# Altium schematic sheet LM35.SchDoc
size A4
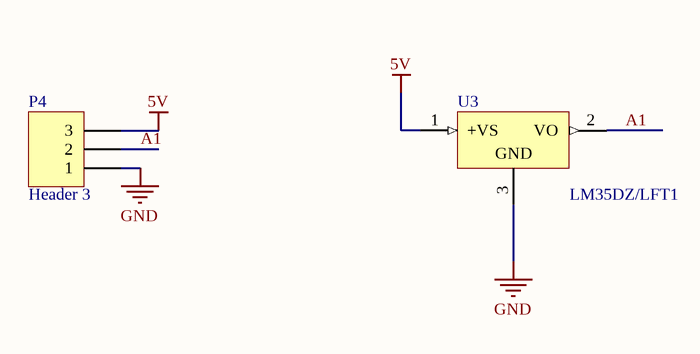
[diagram p0: LM35.SchDoc]

## Parts
P4  Header 3  [HDR1X3]
U3  LM35DZ/LFT1  [Z03A]

## Nets
5V: P4.3 U3.1(+VS)
GND: P4.1 U3.3(GND)
A1: P4.2 U3.2(VO)

## Library data of the parts
P4 = Header 3: Header, 3-Pin; LatestRevisionDate: 17-Jul-2002; LatestRevisionNote: Re-released for DXP Platform.; Publisher: Altium Limited
U3 = LM35DZ/LFT1: IC SENSOR PREC CENT TEMP TO92-3; Manufacturer: Texas Instruments; Sensing Temperature: 0°C ~ 100°C; Output Type: Linear Voltage; Voltage - Supply: 4 V ~ 30 V; Accuracy: ±0.6°C; Supplier 1: Digi-Key; RoHS: RoHS Compliant; Category: Sensors, Transducers; Stock 1: 630; Pricing 1: 1=1.57, 10=1.392, 25=1.2572, 100=1.1001, 250=0.96536, 500=0.8531, 1000=0.6735, 2500=0.6286, 5000=0.59717 (USD); Packaging: Bulk; Package / Case: TO-226-3, TO-92-3 (TO-226AA); Supplier Device Package: TO-92-3; ComponentLink1URL: http://www.ti.com/lit/ds/symlink/lm35.pdf; ComponentLink1Description: http://www.ti.com/lit/ds/symlink/lm35.pdf; Supplier Part Number 1: 296-35151-ND; Manufacturer Part Number: LM35DZ/LFT1